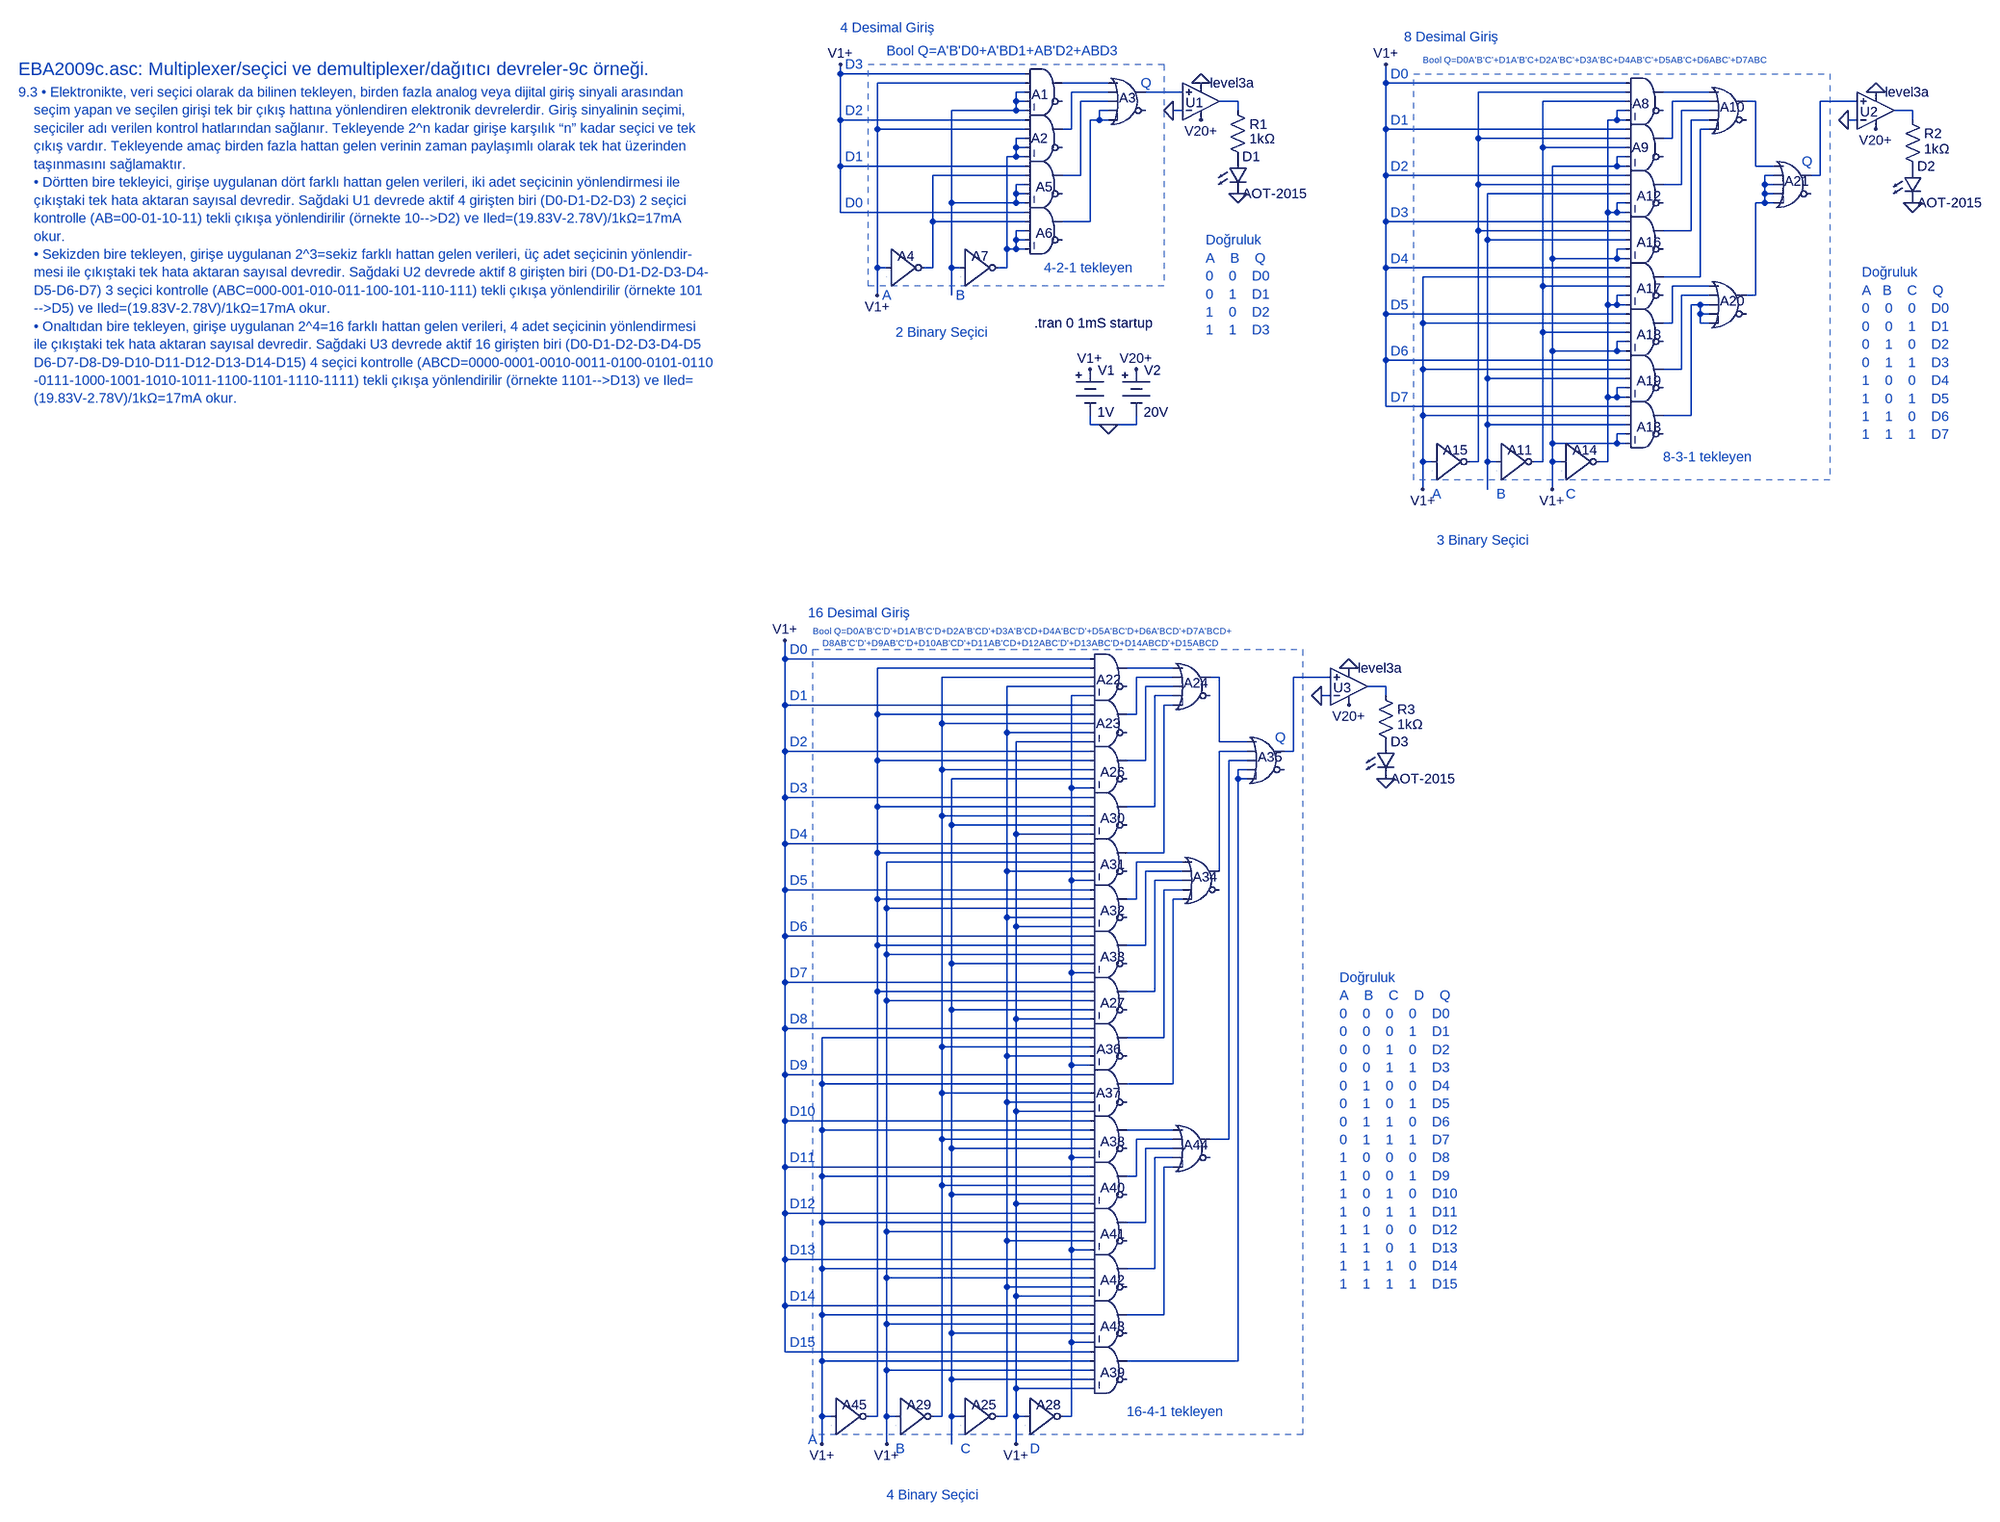
[diagram p0: schematic EBA2009c.asc]
EBA2009c.asc, the LTspice schematic file:
Version 4
SHEET 1 7064 4332
WIRE 1264 64 1264 48
WIRE 1584 64 1264 64
WIRE 1584 80 1328 80
WIRE 1728 80 1648 80
WIRE 2208 80 2208 48
WIRE 2624 80 2208 80
WIRE 1584 96 1568 96
WIRE 1728 96 1664 96
WIRE 1856 96 1792 96
WIRE 2624 96 2368 96
WIRE 2768 96 2688 96
WIRE 1568 112 1568 96
WIRE 1584 112 1568 112
WIRE 1728 112 1680 112
WIRE 1952 112 1920 112
WIRE 2624 112 2480 112
WIRE 2768 112 2704 112
WIRE 2848 112 2832 112
WIRE 3024 112 2960 112
WIRE 1568 128 1568 112
WIRE 1568 128 1456 128
WIRE 1584 128 1568 128
WIRE 1728 128 1712 128
WIRE 1856 128 1840 128
WIRE 1952 128 1952 112
WIRE 2624 128 2608 128
WIRE 2768 128 2720 128
WIRE 3120 128 3088 128
WIRE 1264 144 1264 64
WIRE 1584 144 1264 144
WIRE 1712 144 1712 128
WIRE 1712 144 1696 144
WIRE 1728 144 1712 144
WIRE 2608 144 2608 128
WIRE 2608 144 2592 144
WIRE 2624 144 2608 144
WIRE 2768 144 2736 144
WIRE 3024 144 3008 144
WIRE 3120 144 3120 128
WIRE 1328 160 1328 80
WIRE 1584 160 1328 160
WIRE 1664 160 1664 96
WIRE 1664 160 1648 160
WIRE 2208 160 2208 80
WIRE 2624 160 2208 160
WIRE 2768 160 2752 160
WIRE 1584 176 1568 176
WIRE 2368 176 2368 96
WIRE 2624 176 2368 176
WIRE 2704 176 2704 112
WIRE 2704 176 2688 176
WIRE 1568 192 1568 176
WIRE 1584 192 1568 192
WIRE 2480 192 2480 112
WIRE 2624 192 2480 192
WIRE 1568 208 1568 192
WIRE 1568 208 1552 208
WIRE 1584 208 1568 208
WIRE 2624 208 2608 208
WIRE 1264 224 1264 144
WIRE 1584 224 1264 224
WIRE 2608 224 2608 208
WIRE 2608 224 2496 224
WIRE 2624 224 2608 224
WIRE 2848 224 2848 112
WIRE 2880 224 2848 224
WIRE 1584 240 1424 240
WIRE 1680 240 1680 112
WIRE 1680 240 1648 240
WIRE 2208 240 2208 160
WIRE 2624 240 2208 240
WIRE 2880 240 2864 240
WIRE 2960 240 2960 112
WIRE 2960 240 2944 240
WIRE 1584 256 1568 256
WIRE 2368 256 2368 176
WIRE 2624 256 2368 256
WIRE 2720 256 2720 128
WIRE 2720 256 2688 256
WIRE 2864 256 2864 240
WIRE 2880 256 2864 256
WIRE 1568 272 1568 256
WIRE 1584 272 1568 272
WIRE 2624 272 2384 272
WIRE 2864 272 2864 256
WIRE 2880 272 2864 272
WIRE 1456 288 1456 128
WIRE 1568 288 1568 272
WIRE 1568 288 1456 288
WIRE 1584 288 1568 288
WIRE 2624 288 2608 288
WIRE 2864 288 2864 272
WIRE 2864 288 2848 288
WIRE 2880 288 2864 288
WIRE 1264 304 1264 224
WIRE 1584 304 1264 304
WIRE 2592 304 2592 144
WIRE 2608 304 2608 288
WIRE 2608 304 2592 304
WIRE 2624 304 2608 304
WIRE 1424 320 1424 240
WIRE 1584 320 1424 320
WIRE 1696 320 1696 144
WIRE 1696 320 1648 320
WIRE 2208 320 2208 240
WIRE 2624 320 2208 320
WIRE 1584 336 1568 336
WIRE 2368 336 2368 256
WIRE 2624 336 2368 336
WIRE 2736 336 2736 144
WIRE 2736 336 2688 336
WIRE 1568 352 1568 336
WIRE 1584 352 1568 352
WIRE 2384 352 2384 272
WIRE 2624 352 2384 352
WIRE 1552 368 1552 208
WIRE 1568 368 1568 352
WIRE 1568 368 1552 368
WIRE 1584 368 1568 368
WIRE 2624 368 2608 368
WIRE 2496 384 2496 224
WIRE 2608 384 2608 368
WIRE 2608 384 2496 384
WIRE 2624 384 2608 384
WIRE 1328 400 1328 160
WIRE 1344 400 1328 400
WIRE 1424 400 1424 320
WIRE 1424 400 1408 400
WIRE 1456 400 1456 288
WIRE 1472 400 1456 400
WIRE 1552 400 1552 368
WIRE 1552 400 1536 400
WIRE 2208 400 2208 320
WIRE 2624 400 2208 400
WIRE 2624 416 2272 416
WIRE 2752 416 2752 160
WIRE 2752 416 2688 416
WIRE 2480 432 2480 192
WIRE 2624 432 2480 432
WIRE 2768 432 2704 432
WIRE 1328 448 1328 400
WIRE 1456 448 1456 400
WIRE 2624 448 2608 448
WIRE 2768 448 2720 448
WIRE 2848 448 2848 288
WIRE 2848 448 2832 448
WIRE 2592 464 2592 304
WIRE 2608 464 2608 448
WIRE 2608 464 2592 464
WIRE 2624 464 2608 464
WIRE 2752 464 2736 464
WIRE 2768 464 2752 464
WIRE 2208 480 2208 400
WIRE 2624 480 2208 480
WIRE 2752 480 2752 464
WIRE 2768 480 2752 480
WIRE 2272 496 2272 416
WIRE 2624 496 2272 496
WIRE 2704 496 2704 432
WIRE 2704 496 2688 496
WIRE 2752 496 2752 480
WIRE 2768 496 2752 496
WIRE 2480 512 2480 432
WIRE 2624 512 2480 512
WIRE 2624 528 2608 528
WIRE 2496 544 2496 384
WIRE 2608 544 2608 528
WIRE 2608 544 2496 544
WIRE 2624 544 2608 544
WIRE 2208 560 2208 480
WIRE 2624 560 2208 560
WIRE 2272 576 2272 496
WIRE 2624 576 2272 576
WIRE 2720 576 2720 448
WIRE 2720 576 2688 576
WIRE 2384 592 2384 352
WIRE 2624 592 2384 592
WIRE 2624 608 2608 608
WIRE 2592 624 2592 464
WIRE 2608 624 2608 608
WIRE 2608 624 2592 624
WIRE 2624 624 2608 624
WIRE 2208 640 2208 560
WIRE 2624 640 2208 640
WIRE 2272 656 2272 576
WIRE 2624 656 2272 656
WIRE 2736 656 2736 464
WIRE 2736 656 2688 656
WIRE 1696 672 1696 656
WIRE 1728 672 1696 672
WIRE 1776 672 1776 656
WIRE 1776 672 1728 672
WIRE 2384 672 2384 592
WIRE 2624 672 2384 672
WIRE 2624 688 2608 688
WIRE 2496 704 2496 544
WIRE 2608 704 2608 688
WIRE 2608 704 2496 704
WIRE 2624 704 2608 704
WIRE 2272 736 2272 656
WIRE 2288 736 2272 736
WIRE 2368 736 2368 336
WIRE 2368 736 2352 736
WIRE 2384 736 2384 672
WIRE 2400 736 2384 736
WIRE 2480 736 2480 512
WIRE 2480 736 2464 736
WIRE 2496 736 2496 704
WIRE 2512 736 2496 736
WIRE 2592 736 2592 624
WIRE 2592 736 2576 736
WIRE 2272 784 2272 736
WIRE 2384 784 2384 736
WIRE 2496 784 2496 736
WIRE 1168 1104 1168 1072
WIRE 1696 1104 1168 1104
WIRE 1696 1120 1328 1120
WIRE 1840 1120 1760 1120
WIRE 1696 1136 1440 1136
WIRE 1840 1136 1776 1136
WIRE 1920 1136 1904 1136
WIRE 2112 1136 2048 1136
WIRE 1696 1152 1552 1152
WIRE 1840 1152 1792 1152
WIRE 2208 1152 2176 1152
WIRE 1696 1168 1664 1168
WIRE 1840 1168 1808 1168
WIRE 2112 1168 2096 1168
WIRE 2208 1168 2208 1152
WIRE 1168 1184 1168 1104
WIRE 1696 1184 1168 1184
WIRE 1840 1184 1824 1184
WIRE 1328 1200 1328 1120
WIRE 1696 1200 1328 1200
WIRE 1776 1200 1776 1136
WIRE 1776 1200 1760 1200
WIRE 1440 1216 1440 1136
WIRE 1696 1216 1440 1216
WIRE 1552 1232 1552 1152
WIRE 1696 1232 1552 1232
WIRE 1696 1248 1568 1248
WIRE 1920 1248 1920 1136
WIRE 1968 1248 1920 1248
WIRE 1168 1264 1168 1184
WIRE 1696 1264 1168 1264
WIRE 1968 1264 1920 1264
WIRE 2048 1264 2048 1136
WIRE 2048 1264 2032 1264
WIRE 1328 1280 1328 1200
WIRE 1696 1280 1328 1280
WIRE 1792 1280 1792 1152
WIRE 1792 1280 1760 1280
WIRE 1968 1280 1936 1280
WIRE 1440 1296 1440 1216
WIRE 1696 1296 1440 1296
WIRE 1968 1296 1952 1296
WIRE 1696 1312 1456 1312
WIRE 1952 1312 1952 1296
WIRE 1968 1312 1952 1312
WIRE 1664 1328 1664 1168
WIRE 1696 1328 1664 1328
WIRE 1168 1344 1168 1264
WIRE 1696 1344 1168 1344
WIRE 1328 1360 1328 1280
WIRE 1696 1360 1328 1360
WIRE 1808 1360 1808 1168
WIRE 1808 1360 1760 1360
WIRE 1440 1376 1440 1296
WIRE 1696 1376 1440 1376
WIRE 1456 1392 1456 1312
WIRE 1696 1392 1456 1392
WIRE 1568 1408 1568 1248
WIRE 1696 1408 1568 1408
WIRE 1168 1424 1168 1344
WIRE 1696 1424 1168 1424
WIRE 1328 1440 1328 1360
WIRE 1696 1440 1328 1440
WIRE 1824 1440 1824 1184
WIRE 1824 1440 1760 1440
WIRE 1696 1456 1344 1456
WIRE 1856 1456 1776 1456
WIRE 1552 1472 1552 1232
WIRE 1696 1472 1552 1472
WIRE 1856 1472 1792 1472
WIRE 1920 1472 1920 1264
WIRE 1664 1488 1664 1328
WIRE 1696 1488 1664 1488
WIRE 1856 1488 1808 1488
WIRE 1168 1504 1168 1424
WIRE 1696 1504 1168 1504
WIRE 1856 1504 1824 1504
WIRE 1328 1520 1328 1440
WIRE 1696 1520 1328 1520
WIRE 1776 1520 1776 1456
WIRE 1776 1520 1760 1520
WIRE 1856 1520 1840 1520
WIRE 1344 1536 1344 1456
WIRE 1696 1536 1344 1536
WIRE 1552 1552 1552 1472
WIRE 1696 1552 1552 1552
WIRE 1568 1568 1568 1408
WIRE 1696 1568 1568 1568
WIRE 1168 1584 1168 1504
WIRE 1696 1584 1168 1584
WIRE 1328 1600 1328 1520
WIRE 1696 1600 1328 1600
WIRE 1792 1600 1792 1472
WIRE 1792 1600 1760 1600
WIRE 1344 1616 1344 1536
WIRE 1696 1616 1344 1616
WIRE 1456 1632 1456 1392
WIRE 1696 1632 1456 1632
WIRE 1664 1648 1664 1488
WIRE 1696 1648 1664 1648
WIRE 1168 1664 1168 1584
WIRE 1696 1664 1168 1664
WIRE 1328 1680 1328 1600
WIRE 1696 1680 1328 1680
WIRE 1808 1680 1808 1488
WIRE 1808 1680 1760 1680
WIRE 1344 1696 1344 1616
WIRE 1696 1696 1344 1696
WIRE 1456 1712 1456 1632
WIRE 1696 1712 1456 1712
WIRE 1568 1728 1568 1568
WIRE 1696 1728 1568 1728
WIRE 1168 1744 1168 1664
WIRE 1696 1744 1168 1744
WIRE 1696 1760 1232 1760
WIRE 1824 1760 1824 1504
WIRE 1824 1760 1760 1760
WIRE 1440 1776 1440 1376
WIRE 1696 1776 1440 1776
WIRE 1552 1792 1552 1552
WIRE 1696 1792 1552 1792
WIRE 1664 1808 1664 1648
WIRE 1696 1808 1664 1808
WIRE 1168 1824 1168 1744
WIRE 1696 1824 1168 1824
WIRE 1232 1840 1232 1760
WIRE 1696 1840 1232 1840
WIRE 1840 1840 1840 1520
WIRE 1840 1840 1760 1840
WIRE 1440 1856 1440 1776
WIRE 1696 1856 1440 1856
WIRE 1552 1872 1552 1792
WIRE 1696 1872 1552 1872
WIRE 1568 1888 1568 1728
WIRE 1696 1888 1568 1888
WIRE 1168 1904 1168 1824
WIRE 1696 1904 1168 1904
WIRE 1232 1920 1232 1840
WIRE 1696 1920 1232 1920
WIRE 1840 1920 1760 1920
WIRE 1440 1936 1440 1856
WIRE 1696 1936 1440 1936
WIRE 1840 1936 1776 1936
WIRE 1936 1936 1936 1280
WIRE 1936 1936 1904 1936
WIRE 1456 1952 1456 1712
WIRE 1696 1952 1456 1952
WIRE 1840 1952 1792 1952
WIRE 1664 1968 1664 1808
WIRE 1696 1968 1664 1968
WIRE 1840 1968 1808 1968
WIRE 1168 1984 1168 1904
WIRE 1696 1984 1168 1984
WIRE 1840 1984 1824 1984
WIRE 1232 2000 1232 1920
WIRE 1696 2000 1232 2000
WIRE 1776 2000 1776 1936
WIRE 1776 2000 1760 2000
WIRE 1440 2016 1440 1936
WIRE 1696 2016 1440 2016
WIRE 1456 2032 1456 1952
WIRE 1696 2032 1456 2032
WIRE 1568 2048 1568 1888
WIRE 1696 2048 1568 2048
WIRE 1168 2064 1168 1984
WIRE 1696 2064 1168 2064
WIRE 1232 2080 1232 2000
WIRE 1696 2080 1232 2080
WIRE 1792 2080 1792 1952
WIRE 1792 2080 1760 2080
WIRE 1344 2096 1344 1696
WIRE 1696 2096 1344 2096
WIRE 1552 2112 1552 1872
WIRE 1696 2112 1552 2112
WIRE 1664 2128 1664 1968
WIRE 1696 2128 1664 2128
WIRE 1168 2144 1168 2064
WIRE 1696 2144 1168 2144
WIRE 1232 2160 1232 2080
WIRE 1696 2160 1232 2160
WIRE 1808 2160 1808 1968
WIRE 1808 2160 1760 2160
WIRE 1344 2176 1344 2096
WIRE 1696 2176 1344 2176
WIRE 1552 2192 1552 2112
WIRE 1696 2192 1552 2192
WIRE 1568 2208 1568 2048
WIRE 1696 2208 1568 2208
WIRE 1168 2224 1168 2144
WIRE 1696 2224 1168 2224
WIRE 1232 2240 1232 2160
WIRE 1696 2240 1232 2240
WIRE 1824 2240 1824 1984
WIRE 1824 2240 1760 2240
WIRE 1344 2256 1344 2176
WIRE 1696 2256 1344 2256
WIRE 1456 2272 1456 2032
WIRE 1696 2272 1456 2272
WIRE 1664 2288 1664 2128
WIRE 1696 2288 1664 2288
WIRE 1168 2304 1168 2224
WIRE 1696 2304 1168 2304
WIRE 1232 2320 1232 2240
WIRE 1696 2320 1232 2320
WIRE 1952 2320 1952 1312
WIRE 1952 2320 1760 2320
WIRE 1344 2336 1344 2256
WIRE 1696 2336 1344 2336
WIRE 1456 2352 1456 2272
WIRE 1696 2352 1456 2352
WIRE 1568 2368 1568 2208
WIRE 1696 2368 1568 2368
WIRE 1232 2416 1232 2320
WIRE 1248 2416 1232 2416
WIRE 1328 2416 1328 1680
WIRE 1328 2416 1312 2416
WIRE 1344 2416 1344 2336
WIRE 1360 2416 1344 2416
WIRE 1440 2416 1440 2016
WIRE 1440 2416 1424 2416
WIRE 1456 2416 1456 2352
WIRE 1472 2416 1456 2416
WIRE 1552 2416 1552 2192
WIRE 1552 2416 1536 2416
WIRE 1568 2416 1568 2368
WIRE 1584 2416 1568 2416
WIRE 1664 2416 1664 2288
WIRE 1664 2416 1648 2416
WIRE 1232 2464 1232 2416
WIRE 1344 2464 1344 2416
WIRE 1456 2464 1456 2416
WIRE 1568 2464 1568 2416
FLAG 1888 80 0
FLAG 1888 144 V20+
FLAG 1840 128 0
FLAG 1952 272 0
FLAG 1328 448 V1+
FLAG 1696 576 V1+
FLAG 1776 576 V20+
FLAG 1728 672 0
FLAG 1264 48 V1+
FLAG 3056 96 0
FLAG 3056 160 V20+
FLAG 3008 144 0
FLAG 3120 288 0
FLAG 2208 48 V1+
FLAG 2272 784 V1+
FLAG 2496 784 V1+
FLAG 2144 1120 0
FLAG 2144 1184 V20+
FLAG 2096 1168 0
FLAG 2208 1312 0
FLAG 1168 1072 V1+
FLAG 1344 2464 V1+
FLAG 1568 2464 V1+
FLAG 1232 2464 V1+
SYMBOL Digital\\and 1616 32 R0
WINDOW 0 -21 68 Left 2
SYMATTR InstName A1
SYMBOL Digital\\and 1616 112 R0
WINDOW 0 -22 64 Left 2
SYMATTR InstName A2
SYMBOL Digital\\or 1760 48 R0
WINDOW 0 -14 58 Left 2
SYMATTR InstName A3
SYMBOL Digital\\inv 1344 336 R0
WINDOW 0 19 44 Left 2
SYMATTR InstName A4
SYMBOL Digital\\and 1616 192 R0
WINDOW 0 -14 68 Left 2
SYMATTR InstName A5
SYMBOL Digital\\and 1616 272 R0
WINDOW 0 -14 68 Left 2
SYMATTR InstName A6
SYMBOL Digital\\inv 1472 336 R0
WINDOW 0 19 44 Left 2
SYMATTR InstName A7
SYMBOL OpAmps\\UniversalOpAmp3 1888 112 M180
WINDOW 0 -27 -2 Left 2
SYMATTR InstName U1
SYMBOL res 1936 112 R0
WINDOW 3 36 65 Left 2
SYMATTR Value 1kΩ
SYMATTR InstName R1
SYMBOL LED 1936 208 R0
SYMATTR InstName D1
SYMATTR Value AOT-2015
SYMATTR Description Diode
SYMATTR Type diode
SYMBOL Misc\\battery 1696 560 R0
WINDOW 0 14 18 Left 2
WINDOW 3 13 90 Left 2
SYMATTR InstName V1
SYMATTR Value 1V
SYMBOL Misc\\battery 1776 560 R0
WINDOW 0 14 18 Left 2
WINDOW 3 13 90 Left 2
SYMATTR InstName V2
SYMATTR Value 20V
SYMBOL Digital\\and 2656 48 R0
WINDOW 0 -21 68 Left 2
SYMATTR InstName A8
SYMBOL Digital\\and 2656 128 R0
WINDOW 0 -22 64 Left 2
SYMATTR InstName A9
SYMBOL Digital\\or 2800 64 R0
WINDOW 0 -14 58 Left 2
SYMATTR InstName A10
SYMBOL Digital\\inv 2400 672 R0
WINDOW 0 19 44 Left 2
SYMATTR InstName A11
SYMBOL Digital\\and 2656 208 R0
WINDOW 0 -14 68 Left 2
SYMATTR InstName A12
SYMBOL Digital\\and 2656 608 R0
WINDOW 0 -14 68 Left 2
SYMATTR InstName A13
SYMBOL Digital\\inv 2512 672 R0
WINDOW 0 19 44 Left 2
SYMATTR InstName A14
SYMBOL OpAmps\\UniversalOpAmp3 3056 128 M180
WINDOW 0 -27 -2 Left 2
SYMATTR InstName U2
SYMBOL res 3104 128 R0
WINDOW 3 36 66 Left 2
SYMATTR Value 1kΩ
SYMATTR InstName R2
SYMBOL LED 3104 224 R0
SYMATTR InstName D2
SYMATTR Value AOT-2015
SYMATTR Description Diode
SYMATTR Type diode
SYMBOL Digital\\inv 2288 672 R0
WINDOW 0 19 44 Left 2
SYMATTR InstName A15
SYMBOL Digital\\and 2656 288 R0
WINDOW 0 -14 68 Left 2
SYMATTR InstName A16
SYMBOL Digital\\and 2656 368 R0
WINDOW 0 -14 68 Left 2
SYMATTR InstName A17
SYMBOL Digital\\and 2656 448 R0
WINDOW 0 -14 68 Left 2
SYMATTR InstName A18
SYMBOL Digital\\and 2656 528 R0
WINDOW 0 -14 68 Left 2
SYMATTR InstName A19
SYMBOL Digital\\or 2800 400 R0
WINDOW 0 -14 58 Left 2
SYMATTR InstName A20
SYMBOL Digital\\or 2912 192 R0
WINDOW 0 -14 58 Left 2
SYMATTR InstName A21
SYMBOL Digital\\and 1728 1072 R0
WINDOW 0 -21 68 Left 2
SYMATTR InstName A22
SYMBOL Digital\\and 1728 1152 R0
WINDOW 0 -22 64 Left 2
SYMATTR InstName A23
SYMBOL Digital\\or 1872 1088 R0
WINDOW 0 -14 58 Left 2
SYMATTR InstName A24
SYMBOL Digital\\inv 1472 2352 R0
WINDOW 0 19 44 Left 2
SYMATTR InstName A25
SYMBOL Digital\\and 1728 1232 R0
WINDOW 0 -14 68 Left 2
SYMATTR InstName A26
SYMBOL Digital\\and 1728 1632 R0
WINDOW 0 -14 68 Left 2
SYMATTR InstName A27
SYMBOL Digital\\inv 1584 2352 R0
WINDOW 0 19 44 Left 2
SYMATTR InstName A28
SYMBOL OpAmps\\UniversalOpAmp3 2144 1152 M180
WINDOW 0 -27 -2 Left 2
SYMATTR InstName U3
SYMBOL res 2192 1152 R0
WINDOW 3 36 66 Left 2
SYMATTR Value 1kΩ
SYMATTR InstName R3
SYMBOL LED 2192 1248 R0
SYMATTR InstName D3
SYMATTR Value AOT-2015
SYMATTR Description Diode
SYMATTR Type diode
SYMBOL Digital\\inv 1360 2352 R0
WINDOW 0 19 44 Left 2
SYMATTR InstName A29
SYMBOL Digital\\and 1728 1312 R0
WINDOW 0 -14 68 Left 2
SYMATTR InstName A30
SYMBOL Digital\\and 1728 1392 R0
WINDOW 0 -14 68 Left 2
SYMATTR InstName A31
SYMBOL Digital\\and 1728 1472 R0
WINDOW 0 -14 68 Left 2
SYMATTR InstName A32
SYMBOL Digital\\and 1728 1552 R0
WINDOW 0 -14 68 Left 2
SYMATTR InstName A33
SYMBOL Digital\\or 1888 1424 R0
WINDOW 0 -14 58 Left 2
SYMATTR InstName A34
SYMBOL Digital\\or 2000 1216 R0
WINDOW 0 -14 58 Left 2
SYMATTR InstName A35
SYMBOL Digital\\and 1728 1712 R0
WINDOW 0 -21 68 Left 2
SYMATTR InstName A36
SYMBOL Digital\\and 1728 1792 R0
WINDOW 0 -22 64 Left 2
SYMATTR InstName A37
SYMBOL Digital\\and 1728 1872 R0
WINDOW 0 -14 68 Left 2
SYMATTR InstName A38
SYMBOL Digital\\and 1728 2272 R0
WINDOW 0 -14 68 Left 2
SYMATTR InstName A39
SYMBOL Digital\\and 1728 1952 R0
WINDOW 0 -14 68 Left 2
SYMATTR InstName A40
SYMBOL Digital\\and 1728 2032 R0
WINDOW 0 -14 68 Left 2
SYMATTR InstName A41
SYMBOL Digital\\and 1728 2112 R0
WINDOW 0 -14 68 Left 2
SYMATTR InstName A42
SYMBOL Digital\\and 1728 2192 R0
WINDOW 0 -14 68 Left 2
SYMATTR InstName A43
SYMBOL Digital\\or 1872 1888 R0
WINDOW 0 -14 58 Left 2
SYMATTR InstName A44
SYMBOL Digital\\inv 1248 2352 R0
WINDOW 0 19 44 Left 2
SYMATTR InstName A45
TEXT -232 56 Left 3 ;EBA2009c.asc: Multiplexer/seçici ve demultiplexer/dağıtıcı devreler-9c örneği.
TEXT -232 96 Left 2 ;9.3 • Elektronikte, veri seçici olarak da bilinen tekleyen, birden fazla analog veya dijital giriş sinyali arasından\n    seçim yapan ve seçilen girişi tek bir çıkış hattına yönlendiren elektronik devrelerdir. Giriş sinyalinin seçimi, \n    seçiciler adı verilen kontrol hatlarından sağlanır. Tekleyende 2^n kadar girişe karşılık “n” kadar seçici ve tek\n    çıkış vardır. Tekleyende amaç birden fazla hattan gelen verinin zaman paylaşımlı olarak tek hat üzerinden\n    taşınmasını sağlamaktır.\n    • Dörtten bire tekleyici, girişe uygulanan dört farklı hattan gelen verileri, iki adet seçicinin yönlendirmesi ile \n    çıkıştaki tek hata aktaran sayısal devredir. Sağdaki U1 devrede aktif 4 girişten biri (D0-D1-D2-D3) 2 seçici\n    kontrolle (AB=00-01-10-11) tekli çıkışa yönlendirilir (örnekte 10-->D2) ve Iled=(19.83V-2.78V)/1kΩ=17mA \n    okur.\n    • Sekizden bire tekleyen, girişe uygulanan 2^3=sekiz farklı hattan gelen verileri, üç adet seçicinin yönlendir-\n    mesi ile çıkıştaki tek hata aktaran sayısal devredir. Sağdaki U2 devrede aktif 8 girişten biri (D0-D1-D2-D3-D4-\n    D5-D6-D7) 3 seçici kontrolle (ABC=000-001-010-011-100-101-110-111) tekli çıkışa yönlendirilir (örnekte 101\n    -->D5) ve Iled=(19.83V-2.78V)/1kΩ=17mA okur.\n    • Onaltıdan bire tekleyen, girişe uygulanan 2^4=16 farklı hattan gelen verileri, 4 adet seçicinin yönlendirmesi\n    ile çıkıştaki tek hata aktaran sayısal devredir. Sağdaki U3 devrede aktif 16 girişten biri (D0-D1-D2-D3-D4-D5\n    D6-D7-D8-D9-D10-D11-D12-D13-D14-D15) 4 seçici kontrolle (ABCD=0000-0001-0010-0011-0100-0101-0110\n    -0111-1000-1001-1010-1011-1100-1101-1110-1111) tekli çıkışa yönlendirilir (örnekte 1101-->D13) ve Iled=\n    (19.83V-2.78V)/1kΩ=17mA okur.
TEXT 1272 48 Left 2 ;D3
TEXT 1272 128 Left 2 ;D2
TEXT 1344 24 Left 2 ;Bool Q=A'B'D0+A'BD1+AB'D2+ABD3
TEXT 1616 400 Left 2 ;4-2-1 tekleyen
TEXT 1272 208 Left 2 ;D1
TEXT 1272 288 Left 2 ;D0
TEXT 1896 352 Left 2 ;Doğruluk\nA    B    Q\n0    0    D0\n0    1    D1\n1    0    D2\n1    1    D3
TEXT 1600 496 Left 2 !.tran 0 1mS startup
TEXT 1360 512 Left 2 ;2 Binary Seçici
TEXT 1336 448 Left 2 ;A
TEXT 1464 448 Left 2 ;B
TEXT 1264 -16 Left 2 ;4 Desimal Giriş
TEXT 1784 80 Left 2 ;Q
TEXT 2216 64 Left 2 ;D0
TEXT 2216 144 Left 2 ;D1
TEXT 2272 40 Left 1 ;Bool Q=D0A'B'C'+D1A'B'C+D2A'BC'+D3A'BC+D4AB'C'+D5AB'C+D6ABC'+D7ABC
TEXT 2400 792 Left 2 ;B
TEXT 2688 728 Left 2 ;8-3-1 tekleyen
TEXT 2216 224 Left 2 ;D2
TEXT 2216 304 Left 2 ;D3
TEXT 2520 792 Left 2 ;C
TEXT 3032 408 Left 2 ;Doğruluk\nA   B    C    Q\n0    0    0    D0\n0    0    1    D1\n0    1    0    D2\n0    1    1    D3\n1    0    0    D4\n1    0    1    D5\n1    1    0    D6\n1    1    1    D7
TEXT 2288 792 Left 2 ;A
TEXT 2216 384 Left 2 ;D4
TEXT 2216 464 Left 2 ;D5
TEXT 2216 544 Left 2 ;D6
TEXT 2216 624 Left 2 ;D7
TEXT 2240 0 Left 2 ;8 Desimal Giriş
TEXT 2296 872 Left 2 ;3 Binary Seçici
TEXT 2928 216 Left 2 ;Q
TEXT 1176 1088 Left 2 ;D0
TEXT 1176 1168 Left 2 ;D1
TEXT 1216 1056 Left 1 ;Bool Q=D0A'B'C'D'+D1A'B'C'D+D2A'B'CD'+D3A'B'CD+D4A'BC'D'+D5A'BC'D+D6A'BCD'+D7A'BCD+\n    D8AB'C'D'+D9AB'C'D+D10AB'CD'+D11AB'CD+D12ABC'D'+D13ABC'D+D14ABCD'+D15ABCD
TEXT 1472 2472 Left 2 ;C
TEXT 1760 2408 Left 2 ;16-4-1 tekleyen
TEXT 1176 1248 Left 2 ;D2
TEXT 1176 1328 Left 2 ;D3
TEXT 1592 2472 Left 2 ;D
TEXT 1360 2472 Left 2 ;B
TEXT 1176 1408 Left 2 ;D4
TEXT 1176 1488 Left 2 ;D5
TEXT 1176 1568 Left 2 ;D6
TEXT 1176 1648 Left 2 ;D7
TEXT 1208 1024 Left 2 ;16 Desimal Giriş
TEXT 1344 2552 Left 2 ;4 Binary Seçici
TEXT 2016 1240 Left 2 ;Q
TEXT 1176 1728 Left 2 ;D8
TEXT 1176 1808 Left 2 ;D9
TEXT 1176 1888 Left 2 ;D10
TEXT 1176 1968 Left 2 ;D11
TEXT 1176 2048 Left 2 ;D12
TEXT 1176 2128 Left 2 ;D13
TEXT 1176 2208 Left 2 ;D14
TEXT 1176 2288 Left 2 ;D15
TEXT 1208 2456 Left 2 ;A
TEXT 2128 1656 Left 2 ;Doğruluk\nA    B    C    D    Q\n0    0    0    0    D0\n0    0    0    1    D1\n0    0    1    0    D2\n0    0    1    1    D3\n0    1    0    0    D4\n0    1    0    1    D5\n0    1    1    0    D6\n0    1    1    1    D7\n1    0    0    0    D8\n1    0    0    1    D9\n1    0    1    0    D10\n1    0    1    1    D11\n1    1    0    0    D12\n1    1    0    1    D13\n1    1    1    0    D14\n1    1    1    1    D15
RECTANGLE Normal 1824 432 1312 48 2
RECTANGLE Normal 2976 768 2256 64 2
RECTANGLE Normal 2064 2448 1216 1088 2

The netlist it stands for:
* EBA2009c.asc
A1 V1+ V1+ N002 N002 N002 0 N001 0 AND
A2 V1+ V1+ N019 N019 N019 0 N003 0 AND
A3 N001 N003 N007 N013 N013 0 N004 0 OR
A4 V1+ 0 0 0 0 N020 0 0 BUF
A5 V1+ N020 N002 N002 N002 0 N007 0 AND
A6 V1+ N020 N019 N019 N019 0 N013 0 AND
A7 N002 0 0 0 0 N019 0 0 BUF
XU1 N004 0 V20+ 0 N008 level3a  ; pins In+ In- V+ V- OUT
R1 N008 P001 1kΩ
D1 P001 0 AOT-2015
V1 V1+ 0 1V
V2 V20+ 0 20V
A8 V1+ N005 N009 N014 N014 0 N006 0 AND
A9 V1+ N005 N009 V1+ V1+ 0 N010 0 AND
A10 N006 N010 N015 N017 N018 0 N011 0 OR
A11 N022 0 0 0 0 N009 0 0 BUF
A12 V1+ N005 N022 N014 N014 0 N015 0 AND
A13 V1+ V1+ N022 V1+ V1+ 0 N025 0 AND
A14 V1+ 0 0 0 0 N014 0 0 BUF
XU2 N012 0 V20+ 0 N016 level3a  ; pins In+ In- V+ V- OUT
R2 N016 P002 1kΩ
D2 P002 0 AOT-2015
A15 V1+ 0 0 0 0 N005 0 0 BUF
A16 V1+ N005 N022 V1+ V1+ 0 N017 0 AND
A17 V1+ V1+ N009 N014 N014 0 N018 0 AND
A18 V1+ V1+ N009 V1+ V1+ 0 N023 0 AND
A19 V1+ V1+ N022 N014 N014 0 N024 0 AND
A20 N023 N024 N025 N025 N025 0 N021 0 OR
A21 N011 N021 N021 N021 N021 0 N012 0 OR
A22 V1+ N026 N028 N032 N035 0 N027 0 AND
A23 V1+ N026 N028 N032 V1+ 0 N029 0 AND
A24 N027 N029 N033 N036 N037 0 N030 0 OR
A25 N041 0 0 0 0 N032 0 0 BUF
A26 V1+ N026 N028 N041 N035 0 N033 0 AND
A27 V1+ N026 V1+ N041 V1+ 0 N044 0 AND
A28 V1+ 0 0 0 0 N035 0 0 BUF
XU3 N031 0 V20+ 0 N034 level3a  ; pins In+ In- V+ V- OUT
R3 N034 P003 1kΩ
D3 P003 0 AOT-2015
A29 V1+ 0 0 0 0 N028 0 0 BUF
A30 V1+ N026 N028 N041 V1+ 0 N036 0 AND
A31 V1+ N026 V1+ N032 N035 0 N037 0 AND
A32 V1+ N026 V1+ N032 V1+ 0 N042 0 AND
A33 V1+ N026 V1+ N041 N035 0 N043 0 AND
A34 N042 N043 N044 N045 N046 0 N038 0 OR
A35 N030 N038 N039 N040 N040 0 N031 0 OR
A36 V1+ V1+ N028 N032 N035 0 N045 0 AND
A37 V1+ V1+ N028 N032 V1+ 0 N046 0 AND
A38 V1+ V1+ N028 N041 N035 0 N047 0 AND
A39 V1+ V1+ V1+ N041 V1+ 0 N040 0 AND
A40 V1+ V1+ N028 N041 V1+ 0 N048 0 AND
A41 V1+ V1+ V1+ N032 N035 0 N049 0 AND
A42 V1+ V1+ V1+ N032 V1+ 0 N050 0 AND
A43 V1+ V1+ V1+ N041 N035 0 N051 0 AND
A44 N047 N048 N049 N050 N051 0 N039 0 OR
A45 V1+ 0 0 0 0 N026 0 0 BUF
.model D D
.lib standard.dio
* EBA2009c.asc: Multiplexer/seçici ve demultiplexer/dağıtıcı devreler-9c örneği.
* 9.3 • Elektronikte, veri seçici olarak da bilinen tekleyen, birden fazla analog veya dijital giriş sinyali arasından
*     seçim yapan ve seçilen girişi tek bir çıkış hattına yönlendiren elektronik devrelerdir. Giriş sinyalinin seçimi,
*     seçiciler adı verilen kontrol hatlarından sağlanır. Tekleyende 2^n kadar girişe karşılık “n” kadar seçici ve tek
*     çıkış vardır. Tekleyende amaç birden fazla hattan gelen verinin zaman paylaşımlı olarak tek hat üzerinden
*     taşınmasını sağlamaktır.
*     • Dörtten bire tekleyici, girişe uygulanan dört farklı hattan gelen verileri, iki adet seçicinin yönlendirmesi ile
*     çıkıştaki tek hata aktaran sayısal devredir. Sağdaki U1 devrede aktif 4 girişten biri (D0-D1-D2-D3) 2 seçici
*     kontrolle (AB=00-01-10-11) tekli çıkışa yönlendirilir (örnekte 10-->D2) ve Iled=(19.83V-2.78V)/1kΩ=17mA
*     okur.
*     • Sekizden bire tekleyen, girişe uygulanan 2^3=sekiz farklı hattan gelen verileri, üç adet seçicinin yönlendir-
*     mesi ile çıkıştaki tek hata aktaran sayısal devredir. Sağdaki U2 devrede aktif 8 girişten biri (D0-D1-D2-D3-D4-
*     D5-D6-D7) 3 seçici kontrolle (ABC=000-001-010-011-100-101-110-111) tekli çıkışa yönlendirilir (örnekte 101
*     -->D5) ve Iled=(19.83V-2.78V)/1kΩ=17mA okur.
*     • Onaltıdan bire tekleyen, girişe uygulanan 2^4=16 farklı hattan gelen verileri, 4 adet seçicinin yönlendirmesi
*     ile çıkıştaki tek hata aktaran sayısal devredir. Sağdaki U3 devrede aktif 16 girişten biri (D0-D1-D2-D3-D4-D5
*     D6-D7-D8-D9-D10-D11-D12-D13-D14-D15) 4 seçici kontrolle (ABCD=0000-0001-0010-0011-0100-0101-0110
*     -0111-1000-1001-1010-1011-1100-1101-1110-1111) tekli çıkışa yönlendirilir (örnekte 1101-->D13) ve Iled=
*     (19.83V-2.78V)/1kΩ=17mA okur.
* D3
* D2
* Bool Q=A'B'D0+A'BD1+AB'D2+ABD3
* 4-2-1 tekleyen
* D1
* D0
* Doğruluk
* A    B    Q
* 0    0    D0
* 0    1    D1
* 1    0    D2
* 1    1    D3
.tran 0 1mS startup
* 2 Binary Seçici
* A
* B
* 4 Desimal Giriş
* Q
* D0
* D1
* Bool Q=D0A'B'C'+D1A'B'C+D2A'BC'+D3A'BC+D4AB'C'+D5AB'C+D6ABC'+D7ABC
* B
* 8-3-1 tekleyen
* D2
* D3
* C
* Doğruluk
* A   B    C    Q
* 0    0    0    D0
* 0    0    1    D1
* 0    1    0    D2
* 0    1    1    D3
* 1    0    0    D4
* 1    0    1    D5
* 1    1    0    D6
* 1    1    1    D7
* A
* D4
* D5
* D6
* D7
* 8 Desimal Giriş
* 3 Binary Seçici
* Q
* D0
* D1
* Bool Q=D0A'B'C'D'+D1A'B'C'D+D2A'B'CD'+D3A'B'CD+D4A'BC'D'+D5A'BC'D+D6A'BCD'+D7A'BCD+
*     D8AB'C'D'+D9AB'C'D+D10AB'CD'+D11AB'CD+D12ABC'D'+D13ABC'D+D14ABCD'+D15ABCD
* C
* 16-4-1 tekleyen
* D2
* D3
* D
* B
* D4
* D5
* D6
* D7
* 16 Desimal Giriş
* 4 Binary Seçici
* Q
* D8
* D9
* D10
* D11
* D12
* D13
* D14
* D15
* A
* Doğruluk
* A    B    C    D    Q
* 0    0    0    0    D0
* 0    0    0    1    D1
* 0    0    1    0    D2
* 0    0    1    1    D3
* 0    1    0    0    D4
* 0    1    0    1    D5
* 0    1    1    0    D6
* 0    1    1    1    D7
* 1    0    0    0    D8
* 1    0    0    1    D9
* 1    0    1    0    D10
* 1    0    1    1    D11
* 1    1    0    0    D12
* 1    1    0    1    D13
* 1    1    1    0    D14
* 1    1    1    1    D15
.backanno
.end